# Altium schematic sheet MCU.SchDoc
size A4; SheetNumber: 3; SheetTotal: 5
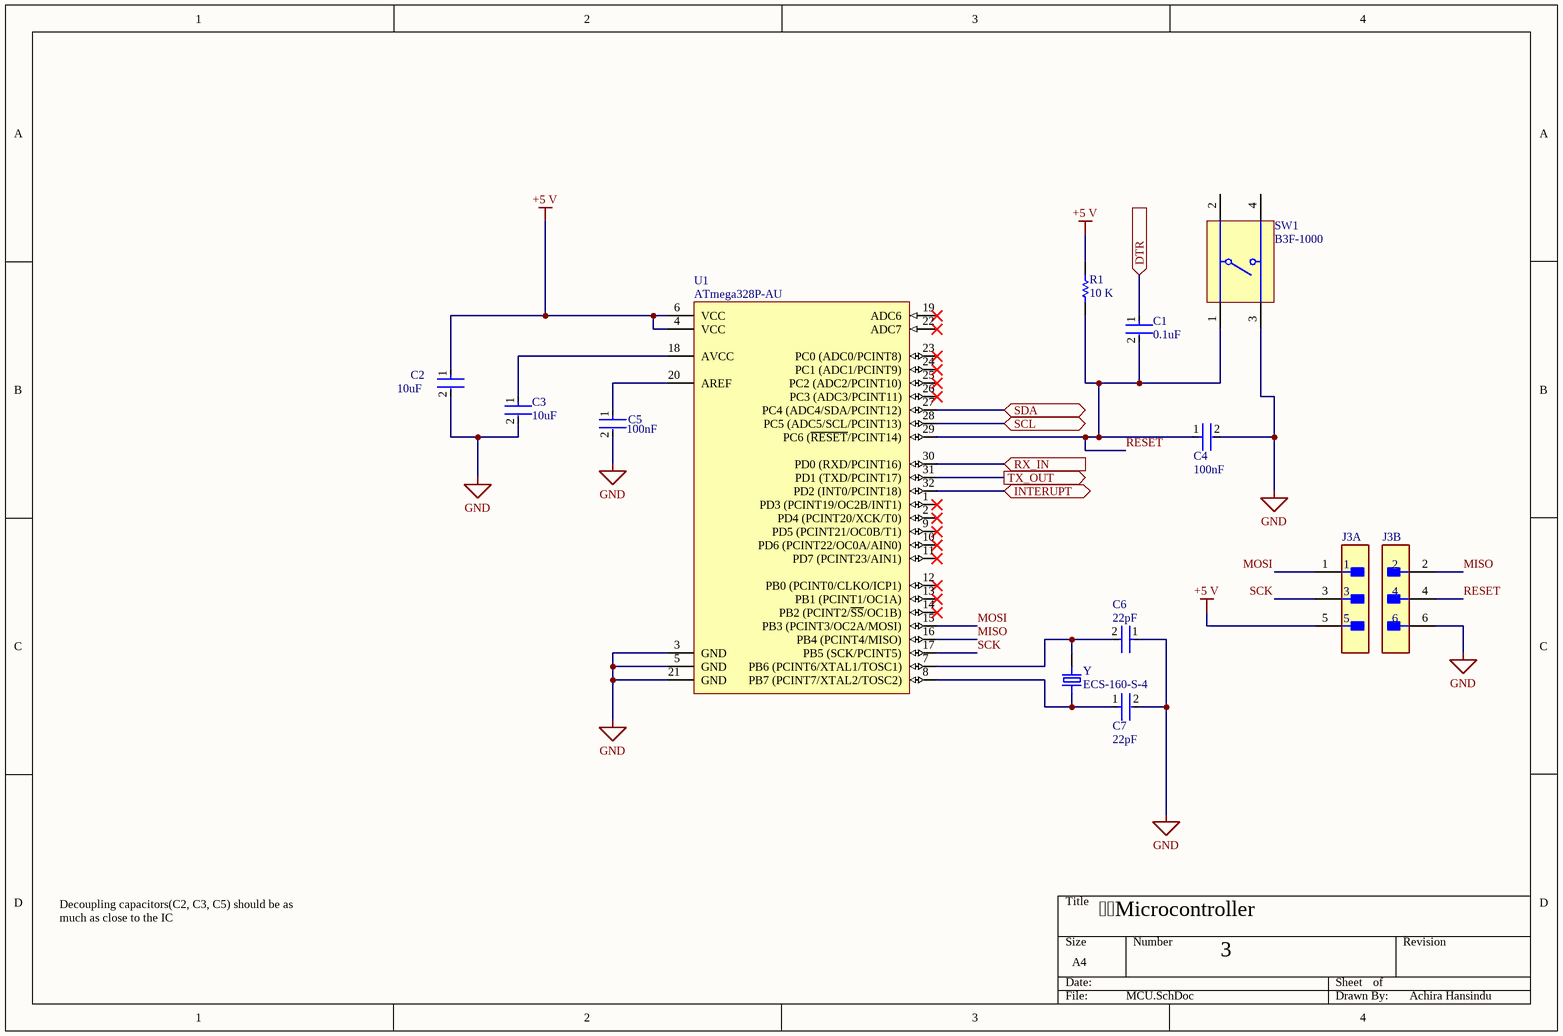
[diagram p0: MCU.SchDoc]

## Parts
C1  Capacitance: 0.1uF  [FP-GRM31M-0_15-IPC_A]  (hidden comment: GRM31M1X1H104JA01L)
C2  Capacitance: 10uF  [FP-C1206C106K4PACTU-MFG]  (hidden comment: C1206C106K4PACTU)
C3  Capacitance: 10uF  [FP-C1206C106K4PACTU-MFG]  (hidden comment: C1206C106K4PACTU)
C4  Capacitance: 100nF  [FP-CL640-IPC_C]  (hidden comment: CL05B104KO5NNWC)
C5  Capacitance: 100nF  [FP-CL640-IPC_C]  (hidden comment: CL05B104KO5NNWC)
C6  value 22pF  [FP-GRM31A-0_2-e0_3_0_8-IPC_B]  (hidden comment: GRM31A7U3D220JW31D)
C7  Capacitance: 22pF  [FP-GRM31A-0_2-e0_3_0_8-IPC_B]  (hidden comment: GRM31A7U3D220JW31D)
J3  90131-0763  [FP-90131-0763-MFG]  (value not drawn)  (parts A,B of 2)
R1  value 10 K  [RESC3216X70X50LL20T25]  (hidden comment: ERA8AEB103V)
SW1  B3F-1000  [OMRON-B3F-1000-4_V]
U1  ATmega328P-AU  [32A_M]
Y  ECS-160-S-4  [XTAL_ECS-160-20-4X]

## Ports
DTR (in, see Main[3B], USB[2B]), INTERUPT (bidir, see Main[2B], Sensor Inputs[3B]), RX_IN (in, see Main[3B]), SCL (bidir, see Main[2B], Sensor Inputs[3B]), SDA (bidir, see Main[2B], Sensor Inputs[3B]), TX_OUT (out, see Main[3B])

## Nets
+5 V: C2.1 J3.5 R1.2 U1.4(VCC) U1.6(VCC)
GND: C2.2 C3.2 C4.2 C5.2 C6.1 C7.2 J3.6 SW1.3 U1.3(GND) U1.5(GND) U1.21(GND)
DTR: C1.1 ; port DTR
INTERUPT: U1.32(PD2_(INT0/PCINT18)) ; port INTERUPT
MISO: J3.2 U1.16(PB4_(PCINT4/MISO))
MOSI: J3.1 U1.15(PB3_(PCINT3/OC2A/MOSI))
RESET: C1.2 C4.1 J3.4 R1.1 SW1.1 U1.29(PC6_(~{RESET}/PCINT14))
RX_IN: U1.30(PD0_(RXD/PCINT16)) ; port RX_IN
SCK: J3.3 U1.17(PB5_(SCK/PCINT5))
SCL: U1.28(PC5_(ADC5/SCL/PCINT13)) ; port SCL
SDA: U1.27(PC4_(ADC4/SDA/PCINT12)) ; port SDA
TX_OUT: U1.31(PD1_(TXD/PCINT17)) ; port TX_OUT
NetC3_1: C3.1 U1.18(AVCC)
NetC5_1: C5.1 U1.20(AREF)
NetC6_2: C6.2 U1.7(PB6_(PCINT6/XTAL1/TOSC1)) Y.2
NetC7_1: C7.1 U1.8(PB7_(PCINT7/XTAL2/TOSC2)) Y.1

Not connected (* = marked no-connect by the designer): SW1 2 4; U1 1(PD3_(PCINT19/OC2B/INT1))* 2(PD4_(PCINT20/XCK/T0))* 9(PD5_(PCINT21/OC0B/T1))* 10(PD6_(PCINT22/OC0A/AIN0))* 11(PD7_(PCINT23/AIN1))* 12(PB0_(PCINT0/CLKO/ICP1))* 13(PB1_(PCINT1/OC1A))* 14(PB2_(PCINT2/~{SS}/OC1B))* 19(ADC6)* 22(ADC7)* 23(PC0_(ADC0/PCINT8))* 24(PC1_(ADC1/PCINT9))* 25(PC2_(ADC2/PCINT10))* 26(PC3_(ADC3/PCINT11))*

## Notes on the sheet
- Microcontroller
- Decoupling capacitors(C2, C3, C5) should be as much as close to the IC
- 3
- Achira Hansindu

## Library data of the parts
C1 = CMP-06035-007547-1: Chip Multilayer Ceramic Capacitors for General Purpose, 1206, 0.10uF, SL, +350/-1000ppm/°C, 5%, 50V; Dissipation Factor: 0.025%; Packaging: Tape and Reel; Length: 0.126inch; Case Code (Imperial): 1206; Voltage Rating (DC): 50V; Max Operating Temperature: 125°C; Voltage: 50V; Height: 1.15mm; Width: 0.063inch; Voltage Rating: 50V; Tolerance: 5%; Min Operating Temperature: -55°C; Mount: Surface Mount; Dielectric Material: Ceramic; Termination: SMD/SMT; Depth: 1.6mm; Case Code (Metric): 3216; Case/Package: 1206; Temperature Coefficient: -1000ppm/°C; Thickness: 0.049inch
C2 C3 = CMP-03020-034688-1: CAP CER 10UF 16V X5R 1206; Dielectric Material: Ceramic; Tolerance: 10%; Lead Free: Lead Free; Length: 3.2mm; Max Operating Temperature: 85°C; Construction: Flat; Radiation Hardening: No; Voltage Rating (DC): 16V; Min Operating Temperature: -55°C; Height: 1.6mm; Packaging: Tape and Reel; Case/Package: 1206; Voltage: 16V; Mount: Surface Mount; Dielectric: X5R; Termination: SMD/SMT; RoHS Compliant: Yes; Depth: 1.6mm
C4 C5 = CMP-13271-001008-1: Cap Ceramic 100nF 16V X7R ±10% SMD 0402 +125°C Paper T/R; Dielectric: X7R; Voltage Rating: 16V; Case Code (Metric): 1005; Case Code (Imperial): 0402; Packaging: Cut Tape; Max Operating Temperature: 125°C; Termination: Wraparound; Mount: Surface Mount; Case/Package: 0402; Package Quantity: 1; Length: 0.039inch; Min Operating Temperature: -55°C; Tolerance: 10%; Contact Plating: Tin; Width: 0.02inch; Thickness: 0.022inch
C6 C7 = CMP-06035-015250-1: Chip Multilayer Ceramic Capacitors for General Purpose, 1206, 22pF, U2J, -750ppm/°C, 5%, 2kV; Voltage Rating (DC): 2kV; Package Quantity: 4000; Case/Package: 1206; Tolerance: 5%; Voltage Rating: 2kV; Depth: 1.6mm; Width: 1.6mm; Length: 3.2mm; Radiation Hardening: No; Termination: SMD/SMT; Weight: 0.000571oz; Dielectric: U2J; Material: Ceramic; Height: 1mm; Min Operating Temperature: -55°C; Mount: Surface Mount; Thickness: 0.039inch; Case Code (Imperial): 1206; Max Operating Temperature: 125°C; Case Code (Metric): 3216; Packaging: Tape and Reel
  C6: Capacitance: 22pF
J3 = CMP-00257-00655468-1: 90131-0763 Conn Unshrouded Header HDR 6 POS 2.54mm Solder ST Top Entry Thru-Hole C-Grid III™ Tray; NexarPartId: 655468; Manufacturer Lifecycle Status: ACTIVE; Number of Poles: 6; Plating: Tin; Current Rating: 3A; Gender: Male; Voltage Rating (AC): 350V; Contact Resistance: 20mΩ; Insulation Resistance: 5GΩ; Pitch: 2.54mm; Height: 9.65mm; Mount: Through Hole; Termination: Through Hole; Contact Plating: Gold; Orientation: Vertical; Material: Glass, Polyester; Min Operating Temperature: -55°C; Lead Free: Lead Free; REACH SVHC: Unknown; Contact Material: Brass; Housing Color: Black; Schedule B: 8536694040; Number of Rows: 2; Lead Pitch: 2.54mm; Number of Circuits: 6; Number of Positions: 6; Lifecycle Status: Production; Max Operating Temperature: 125°C; Voltage Rating: 350V; Voltage Rating (DC): 350V; Country of Origin: SG; Housing Material: Polyester; RoHS: Compliant; Working Voltage: 350V; Number of Contacts: 6; Radiation Hardening: No
R1 = CMP-2003-04407-1: Manufacturer: Panasonic; Part Number: ERA8AEB103V
SW1 = CMP-011-00004-2: Tactile Switch, SPST-NO, 0.05 A, 24 V, -25 to 70 degC, 4-Pin THD, RoHS, Bulk; Manufacturer: Omron Electronic Components; Throw Configuration: SPST; Max Contact Resistance: 100mohm; Resistance: 0.1Ohm; Max Current Rating: 50mA; Voltage Rating: 24V; Operating Force: 100gf; Datasheet Version: Jan-15; Case/Package: B3F-1000; Packaging: Bulk; Package Description: 4-Pin Through Hole Device, Body 6 x 6 mm; Manufacturer URL: http://www.omron.com/; Package Reference: B3F-1000; Contact Plating: Gold; Contact Current Rating: 50mA; RoHS Compliant: True; Contact Material: Gold; Mounting Technology: TH; Max Operating Temperature: 70°C; Min Operating Temperature: -25°C; Package Quantity: 1500; Datasheet URL: http://www.omron.com/ecb/products/pdf/en-b3f.pdf; Voltage Rating (DC): 24V; Pins: 4; Current Rating: 50mA; Max Voltage Rating (DC): 24V
U1 = CMP-0095-00269-2: 8-bit AVR Microcontroller, 32KB Flash, 1KB EEPROM, 2KB SRAM, 32-pin TQFP, Industrial Grade (-40°C to 85°C); PackageDescription: 32-Lead, 7x7x1.0 mm Body, 0.8mm Lead Pitch, Thin Profile Plastic Quad Flat Package (TQFP); DatasheetVersion: revD, May-2011; RevisionNote: DatasheetVersion & PackageVersion updated. URLs added.; ComponentLink1URL: http://www.atmel.com/; ComponentLink2Description: ATmega48A/48PA/88A/88PA/168A/168PA/328/328P Datasheet; Code_JEDEC: MS-026-ABA; ComponentLink1Description: Manufacturer URL; PackageReference: 32A; ComponentLink3Description: ATmega48A/48PA/88A/88PA/168A/168PA/328/328P Summary; ComponentLink2URL: http://www.atmel.com/dyn/resources/prod_documents/doc8271.pdf; PackageVersion: revC, Oct-2010; ComponentLink3URL: http://www.atmel.com/dyn/resources/prod_documents/8271S.pdf
Y = ECS-160-S-4: 16MHz Â±30ppm Crystal Series 40 Ohms HC-49/US; MF: ECS Inc.; SnapEDA_Link: https://www.snapeda.com/parts/ECS-160-S-4/ECS%20Inc./view-part/3657575/?ref=snap; Value: *; Availability: Unavailable; Price: None; MP: ECS-160-S-4; Package: HC49/US ECS International